# EAGLE design infinite (EAGLE 9.6.0)
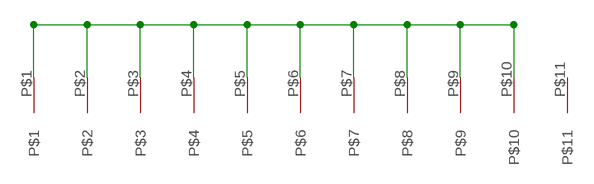
[diagram p0: schematic, sheet 1]

## Parts
U$1  ADVCHIP  [ADCHIP]

## Nets
N$1: U$1.P$1 U$1.P$2 U$1.P$3 U$1.P$4 U$1.P$5 U$1.P$6 U$1.P$7 U$1.P$8 U$1.P$9 U$1.P$10
Unconnected: U$1.P$11

## Library data of the parts
U$1 = advpins:ADVCHIP

## Board
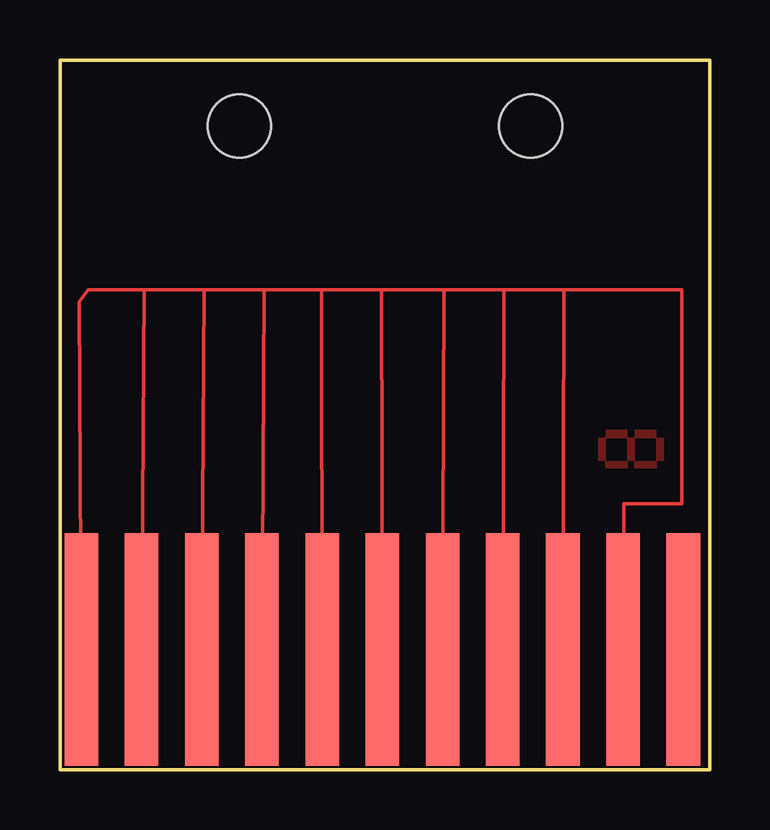
[diagram p1: board, top side]

Size 27.1 x 29.58 mm. Coordinates in mm from the lower left corner, seen from the top.
Outline: 0,29.58 0,0 27.1,0 27.1,29.58 0,29.58
Copper layers (1*16): Top 0.035mm / dielectric 1.5mm / Bottom 0.035mm
Design rules "default": minimum track width 6mil, minimum drill 0.35mm, track to track 6mil, track to pad 6mil, pad to pad 6mil, via to via 6mil, smd to smd 6mil, copper to edge 40mil, drill to drill 6mil, minimum pad ring 10mil, minimum via ring 8mil, stop-mask expansion 4mil, vias tented up to drill 0mil, thermal gap 10mil
Holes 2.62 mm at 7.48,26.83 19.62,26.83

### Footprints (pad centres in the part's own frame; a part is rotated, then mirrored left to right if it is on the bottom)
ADCHIP = smd 1.4 x 9.7: P$1 -27.61,5.02; P$2 -25.1,5.02; P$3 -22.59,5.02; P$4 -20.08,5.02; P$5 -17.57,5.02; P$6 -15.06,5.02; P$7 -12.55,5.02; P$8 -10.04,5.02; P$9 -7.53,5.02; P$10 -5.02,5.02; P$11 -2.51,5.02

### Placement (x,y rotation side)
U$1  28.5,0 0 top

### Tracks (layer width: path | path; a pad name or v marks a point on that pad's centre or on a via)
N$1
  Top 0.152: 23.43,5.03 U$1.P$10 23.5,11.1 25.93,11.1 25.93,20 21,20 | 21,20 18.5,20 | 18.5,20 16,20 | 16,20 13.4,20 | 13.4,20 10.9,20 | 10.9,20 8.5,20 | 8.5,20 6,20 | 6,20 3.5,20 | 3.5,20 1.17,20 0.8,19.5 U$1.P$1 | U$1.P$2 3.5,20 | U$1.P$3 6,20 | U$1.P$4 8.5,20 | U$1.P$5 10.9,20 | U$1.P$6 13.4,20 | U$1.P$7 16,20 | U$1.P$8 18.5,20 | U$1.P$9 21,20
N$2
  pour Top: 24.87,13.81 24.87,12.9 25.17,12.9 25.17,13.81
N$3
  pour Top: 23.96,14.14 23.96,13.84 24.87,13.84 24.87,14.14
N$4
  pour Top: 24.87,12.57 23.96,12.57 23.96,12.87 24.87,12.87
N$5
  pour Top: 23.66,13.81 23.66,12.9 23.96,12.9 23.96,13.81
N$6
  pour Top: 22.75,14.14 22.75,13.84 23.66,13.84 23.66,14.14
N$7
  pour Top: 23.66,12.57 22.75,12.57 22.75,12.87 23.66,12.87
N$8
  pour Top: 22.45,13.81 22.45,12.9 22.75,12.9 22.75,13.81